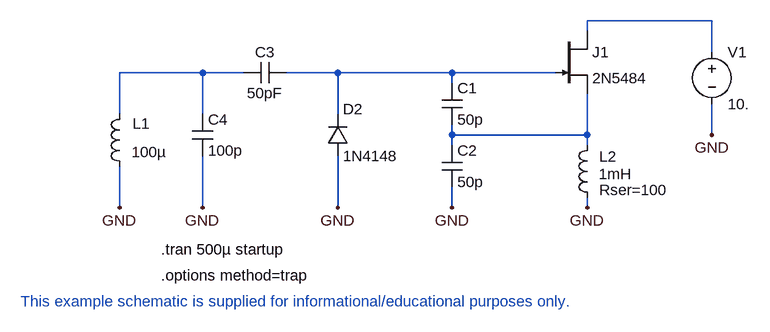
[diagram p0: schematic colpits2.asc]
colpits2.asc, the LTspice schematic file:
Version 4
SHEET 1 2464 2416
WIRE 1488 2112 1488 2048
WIRE 2000 2048 2000 2064
WIRE 2000 2048 2160 2048
WIRE 2000 2128 2000 2144
WIRE 2000 2144 2208 2144
WIRE 2000 2160 2000 2144
WIRE 2208 2144 2208 2160
WIRE 2208 2144 2208 2080
WIRE 2000 2224 2000 2256
WIRE 1488 2192 1488 2256
WIRE 2400 1968 2400 2016
WIRE 2400 2096 2400 2144
WIRE 2208 2256 2208 2240
WIRE 2208 1984 2208 1968
WIRE 2208 1968 2400 1968
WIRE 1616 2112 1616 2048
WIRE 1616 2048 1488 2048
WIRE 1616 2176 1616 2256
WIRE 1744 2048 1824 2048
WIRE 1680 2048 1616 2048
WIRE 1824 2112 1824 2048
WIRE 1824 2048 2000 2048
WIRE 1824 2176 1824 2256
FLAG 1488 2256 GND
FLAG 2000 2256 GND
FLAG 2400 2144 GND
FLAG 2208 2256 GND
FLAG 1616 2256 GND
FLAG 1824 2256 GND
SYMBOL NJF 2160 1984 R0
SYMATTR InstName J1
SYMATTR Value 2N5484
SYMBOL ind 1504 2208 R180
WINDOW 0 -4 82 Right 0
WINDOW 3 -3 38 Right 0
SYMATTR InstName L1
SYMATTR Value 100µ
SYMBOL cap 1984 2064 R0
SYMATTR InstName C1
SYMATTR Value 50p
SYMBOL cap 1984 2160 R0
SYMATTR InstName C2
SYMATTR Value 50p
SYMBOL cap 1744 2032 R90
WINDOW 0 0 32 VBottom 0
WINDOW 3 32 32 VTop 0
SYMATTR InstName C3
SYMATTR Value 50pF
SYMBOL VOLTAGE 2400 2000 R0
SYMATTR InstName V1
SYMATTR Value 10.
SYMBOL cap 1600 2112 R0
SYMATTR InstName C4
SYMATTR Value 100p
SYMBOL ind 2224 2256 R180
WINDOW 0 -3 79 Right 0
WINDOW 3 -2 52 Right 0
WINDOW 39 -3 27 Right 0
SYMATTR InstName L2
SYMATTR Value 1mH
SYMATTR SpiceLine Rser=100
SYMBOL diode 1808 2176 M180
WINDOW 0 24 72 Left 0
WINDOW 3 24 0 Left 0
SYMATTR InstName D2
SYMATTR Value 1N4148
TEXT 1552 2320 Left 0 !.tran 500µ startup
text 1336 2400 Left 0 ;This example schematic is supplied for informational/educational purposes only.
text 1552 2360 Left 0 !.options method=trap

The netlist it stands for:
* colpits2.asc
J1 N004 N002 N003 2N5484
L1 GND N001 100µ
C1 N002 N003 50p
C2 N003 GND 50p
C3 N002 N001 50pF
V1 N004 GND 10.
C4 N001 GND 100p
L2 GND N003 1mH Rser=100
D2 GND N002 1N4148
.model D D
.lib standard.dio
.model NJF NJF
.model PJF PJF
.lib standard.jft
.tran 500µ startup
* This example schematic is supplied for informational/educational purposes only.
.options method=trap
.backanno
.end